# Altium project NEMA17_controller.PrjPcb
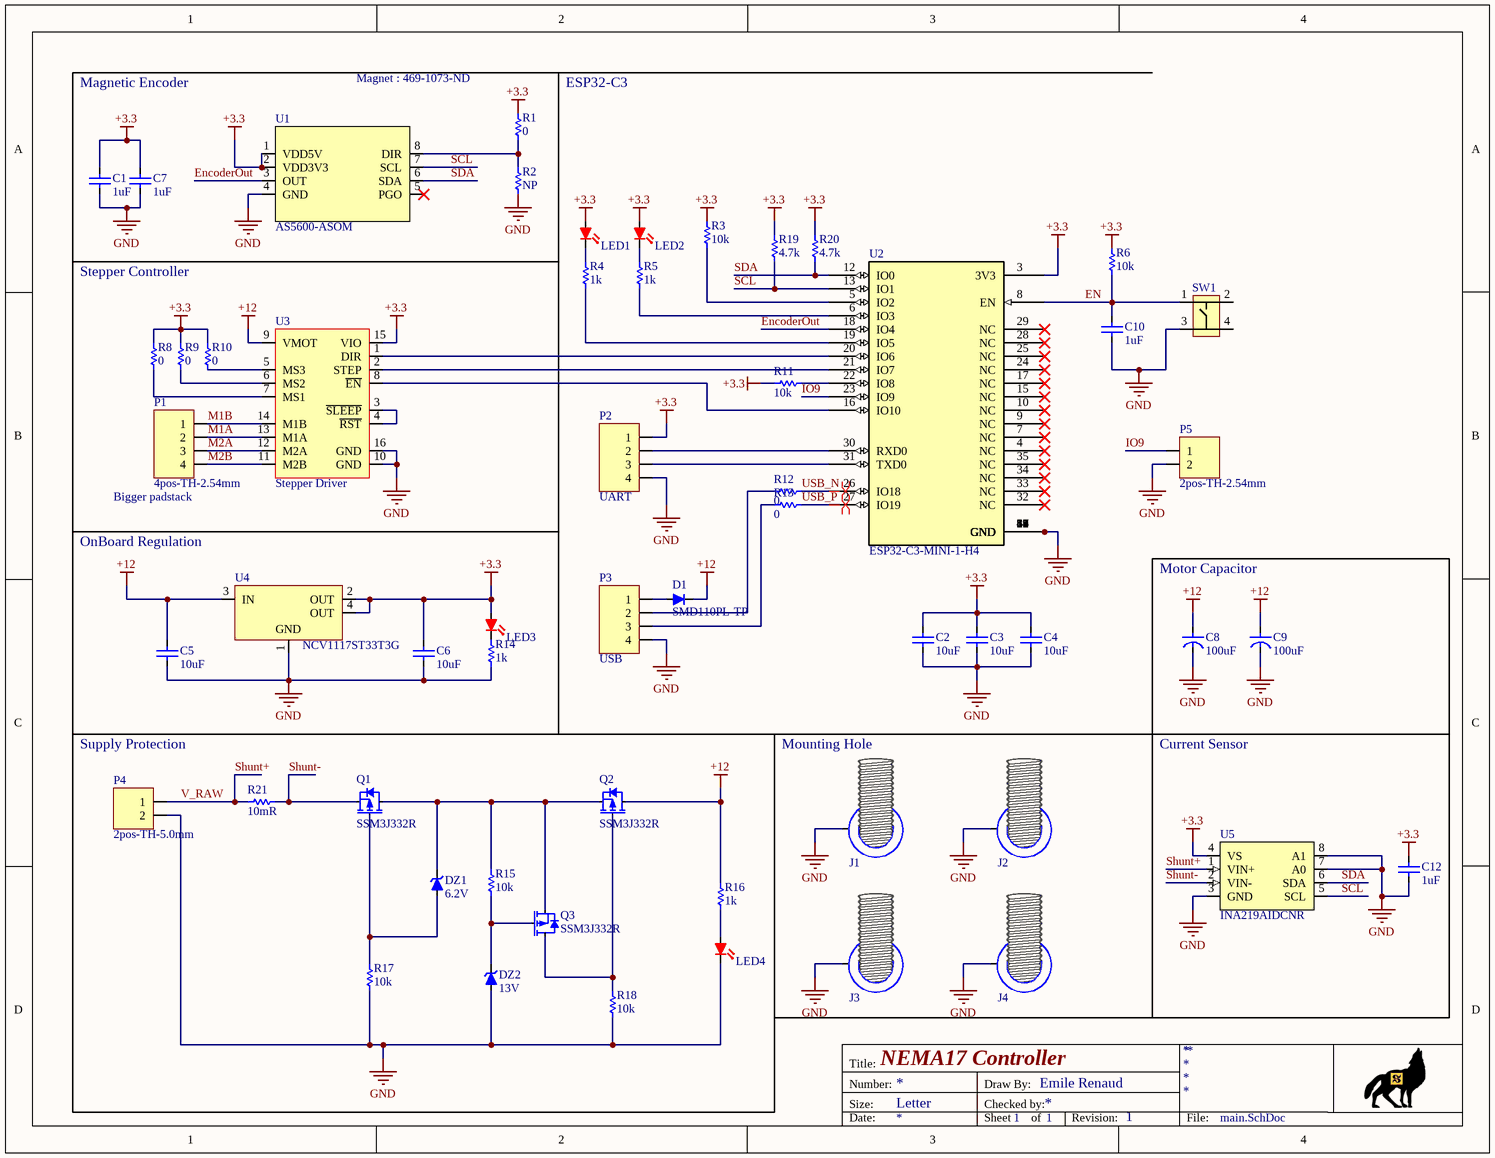
[diagram p0: main.SchDoc]
1 sheet, 56 parts. Net scope: global (net labels, ports and power ports of the same name join across sheets).
Board file: PCB1.PcbDoc

## Sheet main.SchDoc: NEMA17 Controller
size Letter; DrawnBy: Emile Renaud; Revision: 1; SheetNumber: 1; SheetTotal: 1

### Parts
C1  value 1uF  [CAPACITOR-0603]  (hidden comment: Capacitor-0603-1uF-25V-X5R)
C2  value 10uF  [CAPACITOR-0805]  (hidden comment: Capacitor-0805-10uF-35V-X5R)
C3  value 10uF  [CAPACITOR-0805]  (hidden comment: Capacitor-0805-10uF-35V-X5R)
C4  value 10uF  [CAPACITOR-0805]  (hidden comment: Capacitor-0805-10uF-35V-X5R)
C5  value 10uF  [CAPACITOR-0805]  (hidden comment: Capacitor-0805-10uF-35V-X5R)
C6  value 10uF  [CAPACITOR-0805]  (hidden comment: Capacitor-0805-10uF-35V-X5R)
C7  value 1uF  [CAPACITOR-0603]  (hidden comment: Capacitor-0603-1uF-25V-X5R)
C8  value 100uF  [CAPACITOR-Aluminium-5x11mm-2mmPitch]  (hidden comment: CAP ALUM 100UF 20% 25V RADIAL)
C9  value 100uF  [CAPACITOR-Aluminium-5x11mm-2mmPitch]  (hidden comment: CAP ALUM 100UF 20% 25V RADIAL)
C10  value 1uF  [CAPACITOR-0603]  (hidden comment: Capacitor-0603-1uF-25V-X5R)
C12  value 1uF  [CAPACITOR-0603]  (hidden comment: Capacitor-0603-1uF-25V-X5R)
D1  SMD110PL-TP  [SOD-123F]
DZ1  Volt: 6.2V  [SOD-123]  (hidden comment: BZT52C6V2-TP)
DZ2  Volt: 13V  [SOD-123]  (hidden comment: BZT52C13-TP)
J1  hole  [HOLE-3.40MM-M3-8MMEYELET]  (value not drawn)  (no BOM)
J2  hole  [HOLE-3.40MM-M3-8MMEYELET]  (value not drawn)  (no BOM)
J3  hole  [HOLE-3.40MM-M3-8MMEYELET]  (value not drawn)  (no BOM)
J4  hole  [HOLE-3.40MM-M3-8MMEYELET]  (value not drawn)  (no BOM)
LED1  B1911USD-20D000114U1930  [LED-0603-2PIN]  (value not drawn)
LED2  B1911USD-20D000114U1930  [LED-0603-2PIN]  (value not drawn)
LED3  B1911USD-20D000114U1930  [LED-0603-2PIN]  (value not drawn)
LED4  B1911USD-20D000114U1930  [LED-0603-2PIN]  (value not drawn)
P1  4pos-TH-2.54mm  [HDR1X4-W]
P2  UART  [HDR1X4]
P3  USB  [HDR1X4]
P4  2pos-TH-5.0mm  [Weco 2]
P5  2pos-TH-2.54mm  [HDR1X2]
Q1  SSM3J332R  [SOT-23-3]
Q2  SSM3J332R  [SOT-23-3]
Q3  SSM3J332R  [SOT-23-3]
R1  value 0  [Resistor-0603]  (hidden comment: SMT resistor)
R2  value NP  [Resistor-0603]  (hidden comment: SMT resistor)
R3  value 10k  [Resistor-0603]  (hidden comment: SMT resistor)
R4  value 1k  [Resistor-0603]  (hidden comment: SMT resistor)
R5  value 1k  [Resistor-0603]  (hidden comment: SMT resistor)
R6  value 10k  [Resistor-0603]  (hidden comment: SMT resistor)
R8  value 0  [Resistor-0603]  (hidden comment: SMT resistor)
R9  value 0  [Resistor-0603]  (hidden comment: SMT resistor)
R10  value 0  [Resistor-0603]  (hidden comment: SMT resistor)
R11  value 10k  [Resistor-0603]  (hidden comment: SMT resistor)
R12  value 0  [Resistor-0603]  (hidden comment: SMT resistor)
R13  value 0  [Resistor-0603]  (hidden comment: SMT resistor)
R14  value 1k  [Resistor-0603]  (hidden comment: SMT resistor)
R15  value 10k  [Resistor-0603]  (hidden comment: SMT resistor)
R16  value 1k  [Resistor-0603]  (hidden comment: SMT resistor)
R17  value 10k  [Resistor-0603]  (hidden comment: SMT resistor)
R18  value 10k  [Resistor-0603]  (hidden comment: SMT resistor)
R19  value 4.7k  [Resistor-0603]  (hidden comment: SMT resistor)
R20  value 4.7k  [Resistor-0603]  (hidden comment: SMT resistor)
R21  value 10mR  [RESISTOR-1206]  (hidden comment: SMT resistor)
SW1  PTS815 SJM 250 SMTR LFS  [SW4_PTS815 SJM 250 SMTR LFS_CNK]  (value not drawn)
U1  AS5600-ASOM  [AS5600L-ASOM_AMS]
U2  ESP32-C3-MINI-1-H4  [ESP32-C3-MINI-1_EXP]
U3  Stepper Driver  [A4899]
U4  NCV1117ST33T3G  [SOT-223-3/TO-261-3S]
U5  INA219AIDCNR  [SOT-23-8]

### Blocks framed on the sheet
Magnetic Encoder: C1 C7 R1 R2 U1

### Nets
+3.3: C1.2 C2.2 C3.2 C4.2 C6.2 C7.2 C12.2 LED1.2(R) LED2.2(R) LED3.2(R) P2.1 R1.2 R3.2 R6.2 R8.2 R9.2 R10.2 R11.2 R19.2 R20.2 U1.1(VDD5V) U1.2(VDD3V3) U2.3(3V3) U3.15(VIO) U4.2(OUT) U4.4(OUT) U5.4(VS)
+12: C5.2 C8.1 C9.1 D1.2(K) Q2.3(D) R16.2 U3.9(VMOT) U4.3(IN)
GND: C1.1 C2.1 C3.1 C4.1 C5.1 C6.1 C7.1 C8.2 C9.2 C10.1 C12.1 DZ2.1(A) J1.1 J2.1 J3.1 J4.1 LED4.1(K) P2.4 P3.4 P4.2 P5.2 R2.1 R14.1 R17.1 R18.1 SW1.3 U1.4(GND) U2.1(GND) U2.2(GND) U2.11(GND) U2.14(GND) U2.36(GND) U2.37(GND) U2.38(GND) U2.39(GND) U2.40(GND) U2.41(GND) U2.42(GND) U2.43(GND) U2.44(GND) U2.45(GND) U2.46(GND) U2.47(GND) U2.48(GND) U2.49(GND) U2.50(GND) U2.51(GND) U2.52(GND) U2.53(GND) U2.54(GND) U2.55(GND) U2.56(GND) U2.57(GND) U2.58(GND) U2.59(GND) U2.60(GND) U2.61(GND) U3.10(GND) U3.16(GND) U4.1(GND) U5.3(GND) U5.7(A0) U5.8(A1)
EN: C10.2 R6.1 SW1.1 U2.8(EN)
EncoderOut: U1.3(OUT) U2.18(IO4)
IO9: P5.1 U2.23(IO9)
M1A: P1.2 U3.13(M1A)
M1B: P1.1 U3.14(M1B)
M2A: P1.3 U3.12(M2A)
M2B: P1.4 U3.11(M2B)
SCL: R19.1 U1.7(SCL) U2.13(IO1) U5.5(SCL)
SDA: R20.1 U1.6(SDA) U2.12(IO0) U5.6(SDA)
Shunt+: P4.1 R21.1 U5.1(VIN+)  [also labelled V_RAW]
Shunt-: Q1.2(S) R21.2 U5.2(VIN-)
USB_N: R12.2 U2.26(IO18)
USB_P: R13.2 U2.27(IO19)
NetD1_1: D1.1(A) P3.1
NetDZ1_1: DZ1.1(A) Q1.1(G) R17.2
NetDZ1_2: DZ1.2(K) Q1.3(D) Q2.2(S) Q3.2(S) R15.2
NetDZ2_2: DZ2.2(K) Q3.1(G) R15.1
NetLED1_1: LED1.1(K) R4.2
NetLED2_1: LED2.1(K) R5.2
NetLED3_1: LED3.1(K) R14.2
NetLED4_2: LED4.2(R) R16.1
NetP2_2: P2.2 U2.30(RXD0)
NetP2_3: P2.3 U2.31(TXD0)
NetP3_2: P3.2 R12.1
NetP3_3: P3.3 R13.1
NetQ2_1: Q2.1(G) Q3.3(D) R18.2
NetR1_1: R1.1 R2.2 U1.8(DIR)
NetR3_1: R3.1 U2.5(IO2)
NetR4_1: R4.1 U2.19(IO5)
NetR5_1: R5.1 U2.6(IO3)
NetR8_1: R8.1 U3.7(MS1)
NetR9_1: R9.1 U3.6(MS2)
NetR10_1: R10.1 U3.5(MS3)
NetR11_1: R11.1 U2.22(IO8)
NetU2_16: U2.16(IO10) U3.8(~{EN})
NetU2_20: U2.20(IO6) U3.1(DIR)
NetU2_21: U2.21(IO7) U3.2(STEP)
NetU3_3: U3.3(~{SLEEP}) U3.4(~{RST})

Not connected (* = marked no-connect by the designer): SW1 2 4; U1 5(PGO)*; U2 4(NC)* 7(NC)* 9(NC)* 10(NC)* 15(NC)* 17(NC)* 24(NC)* 25(NC)* 28(NC)* 29(NC)* 32(NC)* 33(NC)* 34(NC)* 35(NC)*

### Layout directives
differential pair: USB_N, USB_P

### Notes on the sheet
- Magnet : 469-1073-ND
- (near R1) ESP32-C3
- Stepper Controller
- (near P1) Bigger padstack
- OnBoard Regulation
- Motor Capacitor
- Supply Protection
- Mounting Hole
- Current Sensor
- Title:
- Size:
- Number:
- Letter
- Draw By:
- Checked by:
- Date:
- Sheet
- of
- Revision:
- File:

### Library data of the parts
C1 C7 C10 C12 = Capacitor-0603-1uF-25V-X5R: Precision: X5R-10%; Volt: 25V; Package / Case: Metric 1608, EIA 0603; Mounted: Yes; Supplier 1: Digi-Key; Supplier Part Number 1: 1276-1859-2-ND; Supplier 2: Digi-Key; Supplier 3: Digi-Key; Supplier 4: Digi-Key; Supplier Part Number 2: 1276-1942-2-ND
C2-C6 = Capacitor-0805-10uF-35V-X5R: Precision: X5R-10%; Volt: 35V; Package / Case: Metric 2012 , EIA 0805; Mounted: Yes; Supplier 1: Digi-Key; Supplier Part Number 1: 490-10515-1-ND; Supplier 2: Digi-Key; Supplier 3: Digi-Key; Supplier 4: Digi-Key
C8 C9 = Capacitor-100uF-25V: Volt: 25V; Precision: 20%; Mounted: Yes; Supplier 1: Digi-Key; Supplier Part Number 1: 399-6102-ND; Supplier 2: Digi-Key; Supplier 3: Digi-Key; Supplier 4: Digi-Key
D1 = SMD110PL-TP: DIODE SCHOTTKY 100V 1A SOD123FL; Supplier 1: Digi-Key; Supplier Part Number 1: SMD110PL-TPMSTR-ND; Mounted: Yes; Package / Case: SOD123FL; Volt: 100V
DZ1 = BZT52C6V2-TP: Zener Diode 6.2 V 200 mW ±6% Surface Mount SOD-123; Watt: 200mW; Grade: None; Package / Case: SOD-123; Supplier 1: Digi-Key; Supplier Part Number 1: BZT52C6V2; Mounted: Yes; Precision: 6%
DZ2 = BZT52C13-TP: Zener Diode 13 V 200 mW ±6% Surface Mount SOD-123; Watt: 200mW; Grade: None; Package / Case: SOD-123; Supplier 1: Digi-Key; Supplier Part Number 1: BZT52C13-TPMSCT-ND; Mounted: Yes; Precision: 6%
J1-J4 = Hole 3.40mm M3-Eyelet: Hole for M3 Bolt with 8mm pad; Mounted: N/A
LED1-LED4 = B1911USD-20D000114U1930: LED RED CLEAR 1608 SMD; Package / Case: 0603 (1608 Metric); Mounted: Yes; Supplier 1: Digi-Key; Supplier Part Number 1: 3147-B1911USD-20D000114U1930CT-ND
P1-P3 = 4pos-TH-2.54mm: 4pos TH 2.54mm Header; Supplier 1: Digi-Key; Supplier Part Number 1: N/A; Mounted: Yes; Package / Case: TH; Volt: N/A
P4 = 2pos-TH-5.0mm: 2pos-TH-5.0mm Screw Terminal; Supplier 1: Digi-Key; Supplier Part Number 1: N/A277-1667-ND; Mounted: Yes; Package / Case: TH; Volt: N/A
P5 = 2pos-TH-2.54mm: 2pos TH 2.54mm Header; Supplier 1: Digi-Key; Supplier Part Number 1: N/A; Mounted: Yes; Package / Case: TH; Volt: N/A
Q1-Q3 = SSM3J332R: P-Channel 30 V 6A (Ta) 1W (Ta) Surface Mount SOT-23F; Volt: 30V; Supplier 1: Digi-Key; Supplier Part Number 1: SSM3J332RLFCT-ND; Package / Case: SOT-523; Mounted: Yes; Current: 6A
R1 R2 R8-R10 R12 R13 = Resistor0603-0.0: Precision: 1%; Watt: 0.1W; Mounted: Yes; Package / Case: Metric 1608, EIA 0603; Supplier 2: Digi-Key; Supplier 4: Digi-Key; Supplier Part Number 2: 1276-3510-2-ND; Supplier Part Number 4: 541-0.0GTR-ND; Supplier 1: Digi-Key; Supplier 3: Digi-Key; Supplier Part Number 1: RMCF0603ZT0R00TR-ND; Supplier Part Number 3: YAG1307TR-ND
R3 R6 R11 R15 R17 R18 = Resistor0603-10k: Precision: 1%; Watt: 0.1W; Mounted: Yes; Package / Case: Metric 1608, EIA 0603; Supplier 2: Digi-Key; Supplier 4: Digi-Key; Supplier Part Number 2: RMCF0603FT10K0TR-ND; Supplier 1: Digi-Key; Supplier 3: Digi-Key; Supplier Part Number 1: 311-10.0KHRTR-ND
R4 R5 R14 R16 = Resistor0603-1k: Precision: 1%; Watt: 0.1W; Mounted: Yes; Package / Case: Metric 1608, EIA 0603; Supplier 2: Digi-Key; Supplier 4: Digi-Key; Supplier Part Number 2: 311-1.00KHRTR-ND; Supplier 1: Digi-Key; Supplier 3: Digi-Key; Supplier Part Number 1: RMCF0603FT1K00TR-ND; Supplier Part Number 3: AG1307TR-ND
R19 R20 = Resistor0603-4.7k: Precision: 1%; Watt: 0.1W; Mounted: Yes; Package / Case: Metric 1608, EIA 0603; Supplier 2: Digi-Key; Supplier 4: Digi-Key; Supplier Part Number 2: RMCF0603FT4K70TR-ND; Supplier 1: Digi-Key; Supplier 3: Digi-Key; Supplier Part Number 1: 311-4.70KHRTR-ND
R21 = Resistor1206-10mR: Precision: 1%; Watt: 0.5W; Mounted: Yes; Package / Case: Metric 3216, EIA 1206; Supplier 2: Digi-Key; Supplier 4: Digi-Key; Supplier 1: Digi-Key; Supplier 3: Digi-Key; Supplier Part Number 1: CSR1206FT10L0CT-ND
SW1 = PTS815 SJM 250 SMTR LFS: TACT 4.2 X 3.2, 2.5 MM H, 180GF,; Volt: 12V; Current: 0.05A; Supplier 1: Digi-Key; Supplier Part Number 1: CKN12215-1-ND; Mounted: Yes
U1 = AS5600-ASOM: SENSOR ANGLE 360DEG SMD; Mfr_Name: ams OSRAM; Manufacturer_Part_Number: AS5600L-ASOM; Copyright: Copyright (C) 2023 Ultra Librarian. All rights reserved.; RefDes: RefDes; Type: DEV
U2 = ESP32-C3-MINI-1-N4: Bluetooth, WiFi 802.11b/g/n, Bluetooth v5.0 Transceiver Module 2.412GHz ~ 2.484GHz PCB Trace Surface Mount; Mfr_Name: Espressif Systems; Copyright: Copyright (C) 2023 Ultra Librarian. All rights reserved.; Manufacturer_Part_Number: ESP32-C3-MINI-1-N4; RefDes: RefDes; Type: Type; Datasheet: https://www.espressif.com/sites/default/files/documentation/esp32-c3-mini-1_datasheet_en.pdf
U3 = A4988: Stepper Driver PCB; Supplier 1: Digi-Key; Package / Case: Custom; Mounted: Yes
U4 = NCV1117ST33T3G: IC REG LINEAR 3.3V 1A SOT223; Supplier 1: Digi-Key; Supplier Part Number 1: NCV1117ST33T3GOSCT-ND; Package / Case: SOT223; Mounted: Yes
U5 = INA219: IC CURRENT MONITOR 1% SOT23-8; Supplier 1: Digi-Key; Supplier Part Number 1: 296-23770-1-ND; Package / Case: SOT-23-8; Mounted: Yes